# EAGLE design temp (EAGLE 7.1.0)
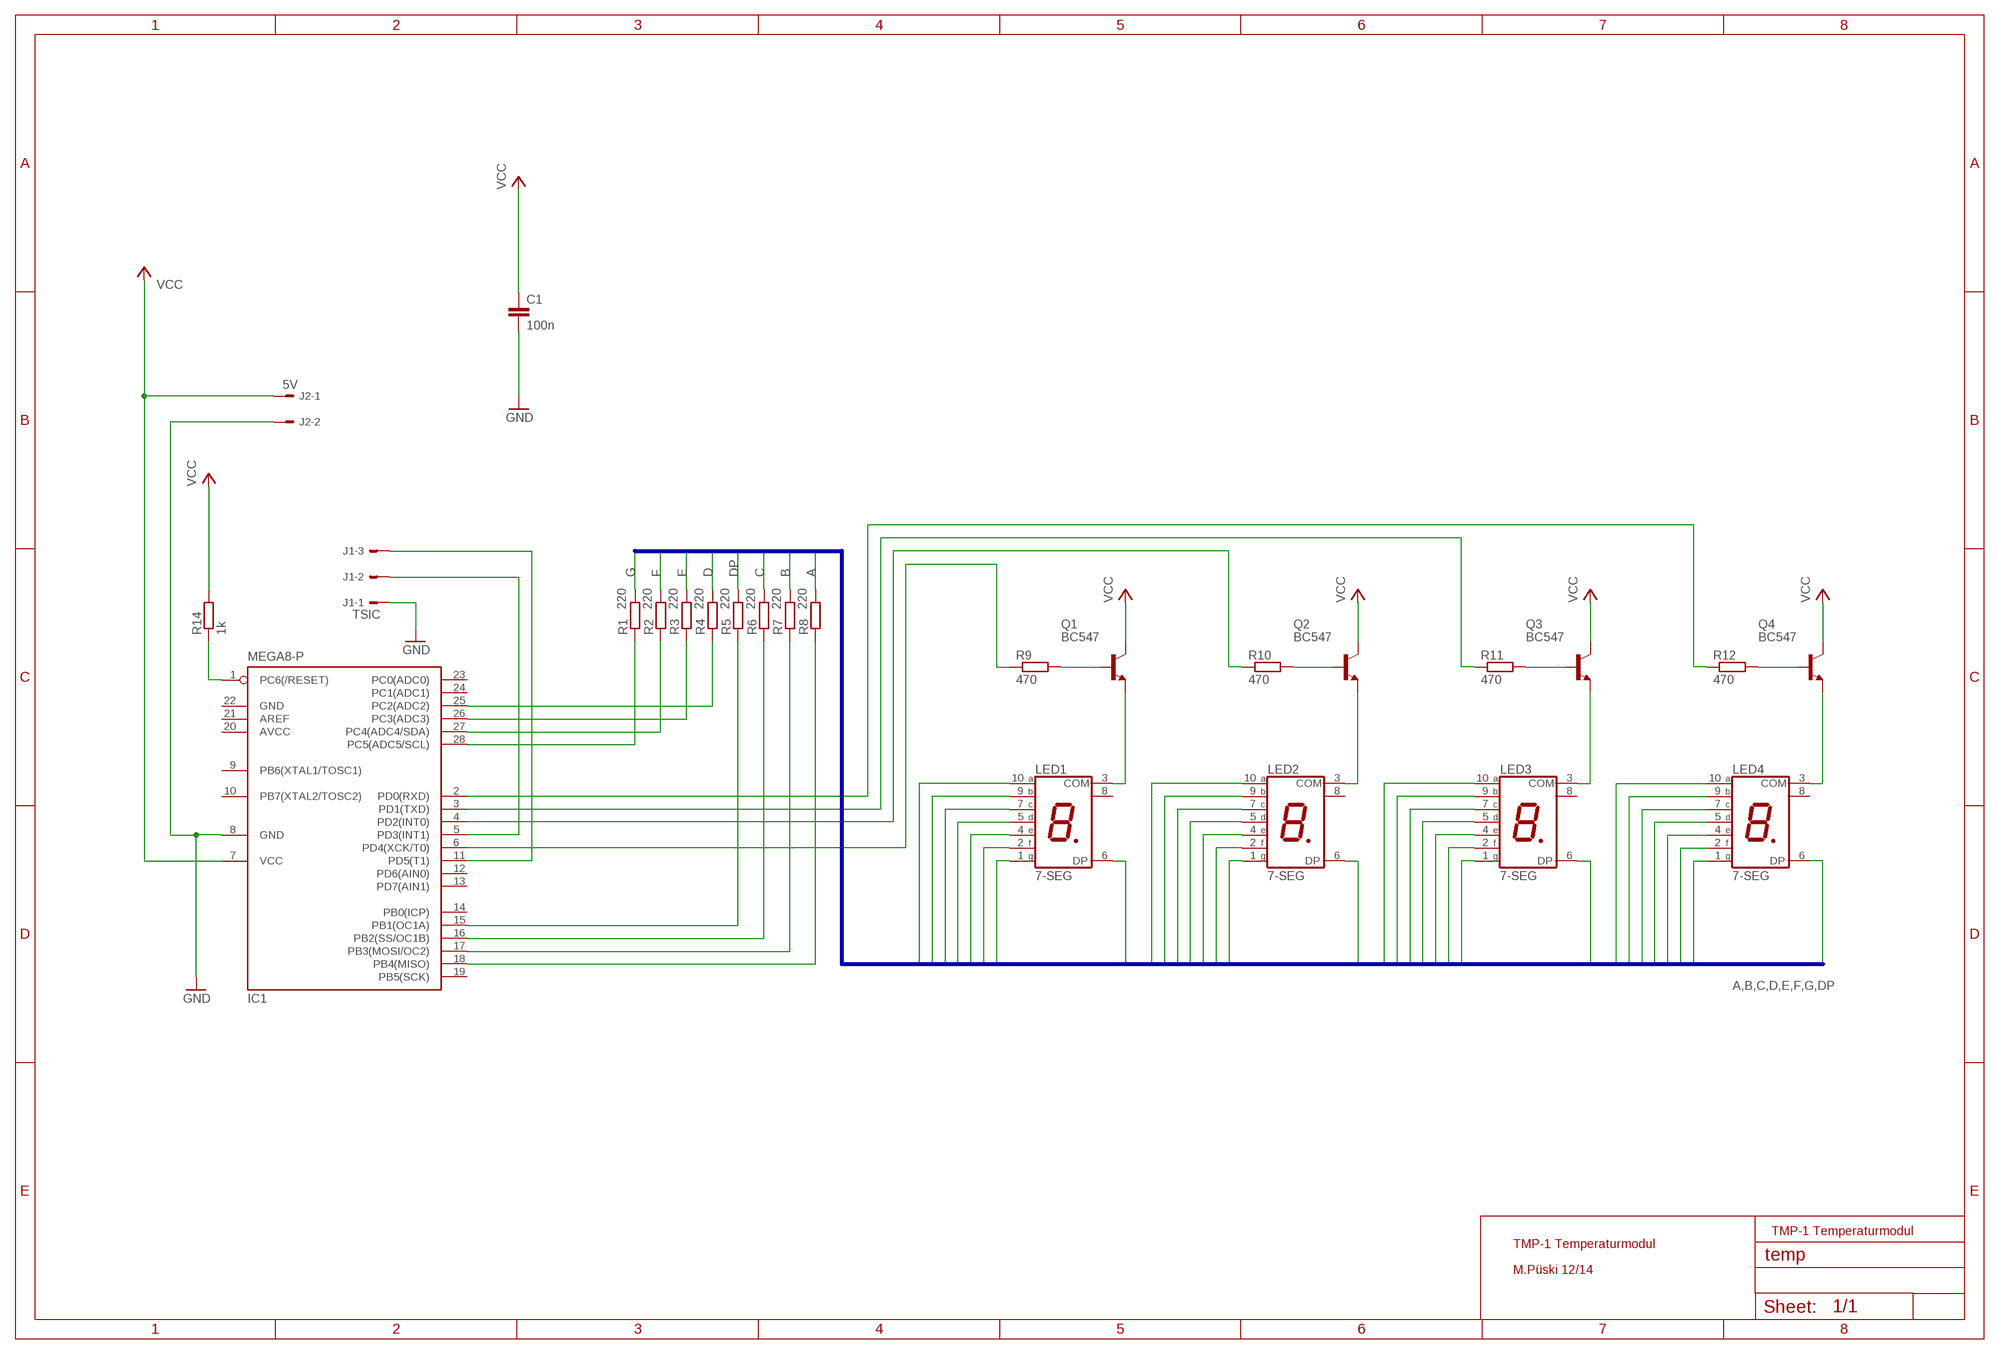
[diagram p0: schematic, sheet 1]

## Parts
C1  100n  C-EU050-024X044  [C050-024X044]
IC1  MEGA8-P  [DIL28-3]
J1  TSIC  22-27-2031-03  [6410-03]
J2  5V  22-27-2021-02  [6410-02]
LED1  7-SEG  7-SEG_SA39-11SRWA  [SA39-11SRWA]
LED2  7-SEG  7-SEG_SA39-11SRWA  [SA39-11SRWA]
LED3  7-SEG  7-SEG_SA39-11SRWA  [SA39-11SRWA]
LED4  7-SEG  7-SEG_SA39-11SRWA  [SA39-11SRWA]
Q1  BC547  [TO92]
Q2  BC547  [TO92]
Q3  BC547  [TO92]
Q4  BC547  [TO92]
R1  220  R-EU_0204_7  [0204/7]
R2  220  R-EU_0204_7  [0204/7]
R3  220  R-EU_0204_2V  [0204V]
R4  220  R-EU_0204_7  [0204/7]
R5  220  R-EU_0204_7  [0204/7]
R6  220  R-EU_0204_7  [0204/7]
R7  220  R-EU_0204_7  [0204/7]
R8  220  R-EU_0204_7  [0204/7]
R9  470  R-EU_0204_7  [0204/7]
R10  470  R-EU_0204_7  [0204/7]
R11  470  R-EU_0204_2V  [0204V]
R12  470  R-EU_0204_7  [0204/7]
R14  1k  R-EU_0204_7  [0204/7]

## Nets
A: LED1.10(A) LED2.10(A) LED3.10(A) LED4.10(A) R8.2
B: LED1.9(B) LED2.9(B) LED3.9(B) LED4.9(B) R7.2
C: LED1.7(C) LED2.7(C) LED3.7(C) LED4.7(C) R6.2
D: LED1.5(D) LED2.5(D) LED3.5(D) LED4.5(D) R4.2
DP: LED1.6(DP) LED2.6(DP) LED3.6(DP) LED4.6(DP) R5.2
E: LED1.4(E) LED2.4(E) LED3.4(E) LED4.4(E) R3.2
F: LED1.2(F) LED2.2(F) LED3.2(F) LED4.2(F) R2.2
G: LED1.1(G) LED2.1(G) LED3.1(G) LED4.1(G) R1.2
GND: C1.2 IC1.8(GND) J1.1 J2.2
N$2: IC1.27(PC4(ADC4/SDA)) R2.1
N$3: IC1.26(PC3(ADC3)) R3.1
N$4: IC1.25(PC2(ADC2)) R4.1
N$5: IC1.15(PB1(OC1A)) R5.1
N$6: IC1.16(PB2(SS/OC1B)) R6.1
N$7: IC1.17(PB3(MOSI/OC2)) R7.1
N$8: IC1.18(PB4(MISO)) R8.1
N$9: Q1.2(B) R9.2
N$10: Q2.2(B) R10.2
N$11: Q3.2(B) R11.2
N$12: LED3.3(COM) Q3.1(E)
N$13: LED2.3(COM) Q2.1(E)
N$14: LED1.3(COM) Q1.1(E)
N$15: IC1.2(PD0(RXD)) R12.1
N$16: IC1.3(PD1(TXD)) R11.1
N$17: IC1.4(PD2(INT0)) R10.1
N$18: IC1.28(PC5(ADC5/SCL)) R1.1
N$19: Q4.2(B) R12.2
N$20: LED4.3(COM) Q4.1(E)
N$21: IC1.1(PC6(/RESET)) R14.1
N$22: IC1.6(PD4(XCK/T0)) R9.1
N$23: IC1.11(PD5(T1)) J1.3
N$24: IC1.5(PD3(INT1)) J1.2
VCC: C1.1 IC1.7(VCC) J2.1 Q1.3(C) Q2.3(C) Q3.3(C) Q4.3(C) R14.2
Unconnected: IC1.9(PB6(XTAL1/TOSC1)) IC1.10(PB7(XTAL2/TOSC2)) IC1.12(PD6(AIN0)) IC1.13(PD7(AIN1)) IC1.14(PB0(ICP)) IC1.19(PB5(SCK)) IC1.21(AREF) IC1.23(PC0(ADC0)) IC1.24(PC1(ADC1)) LED1.8(COM) LED2.8(COM) LED3.8(COM) LED4.8(COM)

## Buses
A,B,C,D,E,F,G,DP

## Notes on the sheet
- TMP-1 Temperaturmodul
- TMP-1 Temperaturmodul
- M.Püski 12/14

## Power pins joined to a net without a drawn wire
AVCC: IC1.20(AVCC)
GND: IC1.22(GND)

## Library data of the parts
C1 = rcl:C-EU: CAPACITOR, European symbol
IC1 = atmel:MEGA8-P: MICROCONTROLLER 8 Kbytes FLASH, 1 kbytes SRAM, 512 bytes EEPROM, USART, 4-channel 10 bit ADC, 2-channel 8 bit ADC Pin compatible with Atmega48, ATMega88, ATMega168 Source: avr.lbr; OC_FARNELL: unknown; OC_NEWARK: unknown
J1 = con-molex:22-?-03: CONNECTOR wire to board 2.54 mm (.1 inch) pitch header; OC_FARNELL: unknown; OC_NEWARK: unknown
J2 = con-molex:22-?-02: CONNECTOR wire to board 2.54 mm (.1 inch) pitch header; OC_FARNELL: unknown; OC_NEWARK: unknown
LED1-LED4 = display-kingbright:7-SEG_: Kingbright 14.2mm (0.56 INCH) SINGLE DIGIT NUMERIC DUISPLAY Source: SA56-11EWA(Ver1189471036.pdf; OC_FARNELL: unknown; OC_NEWARK: unknown
Q1-Q4 = transistor-npn:BC547*: NPN Transistor
R1-R12 R14 = resistor:R-EU_: RESISTOR, European symbol; SPICEPREFIX: R

## Board
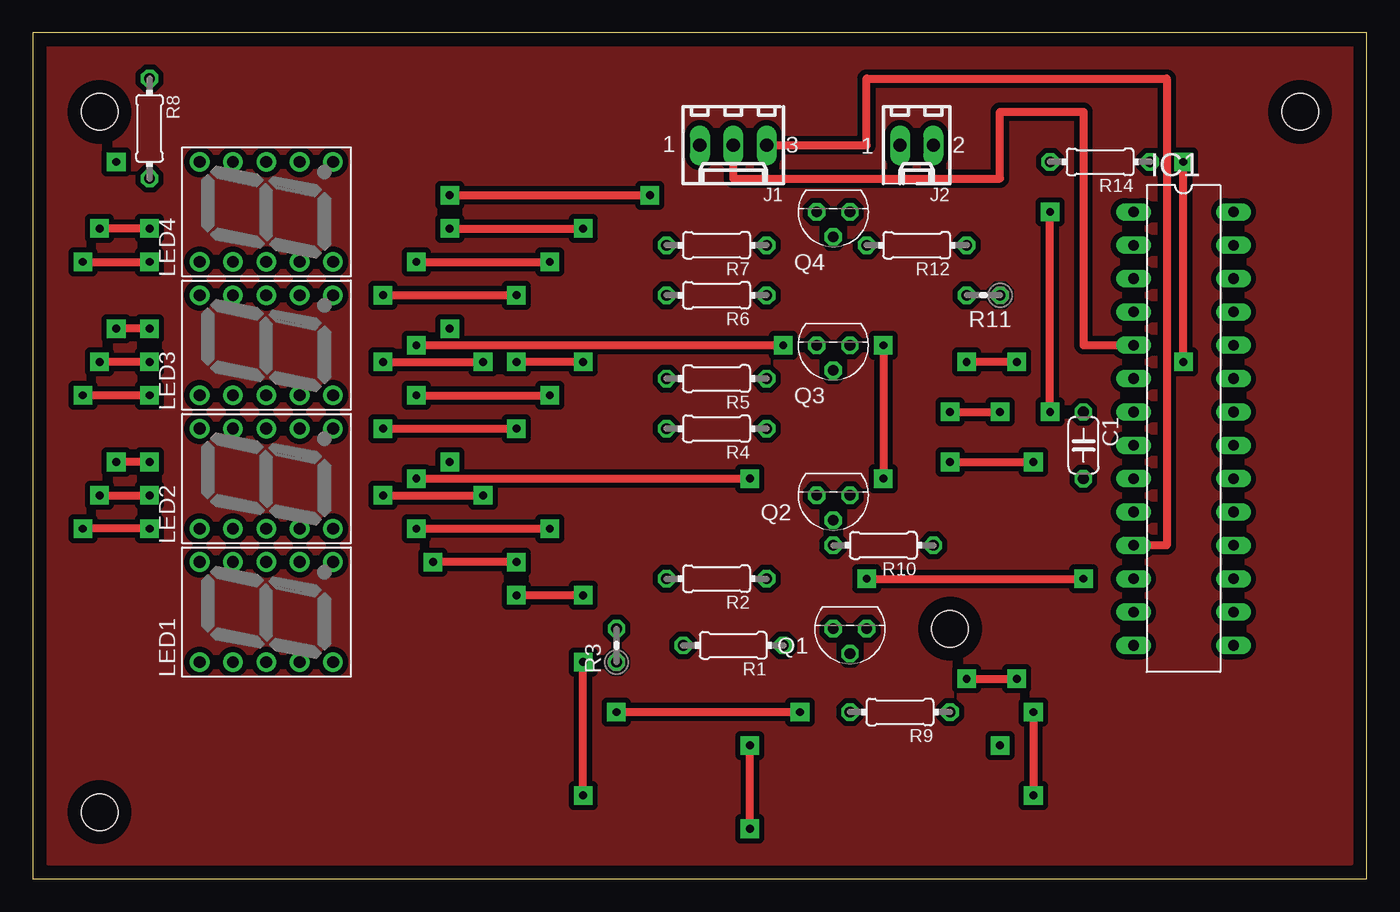
[diagram p1: board, top side]
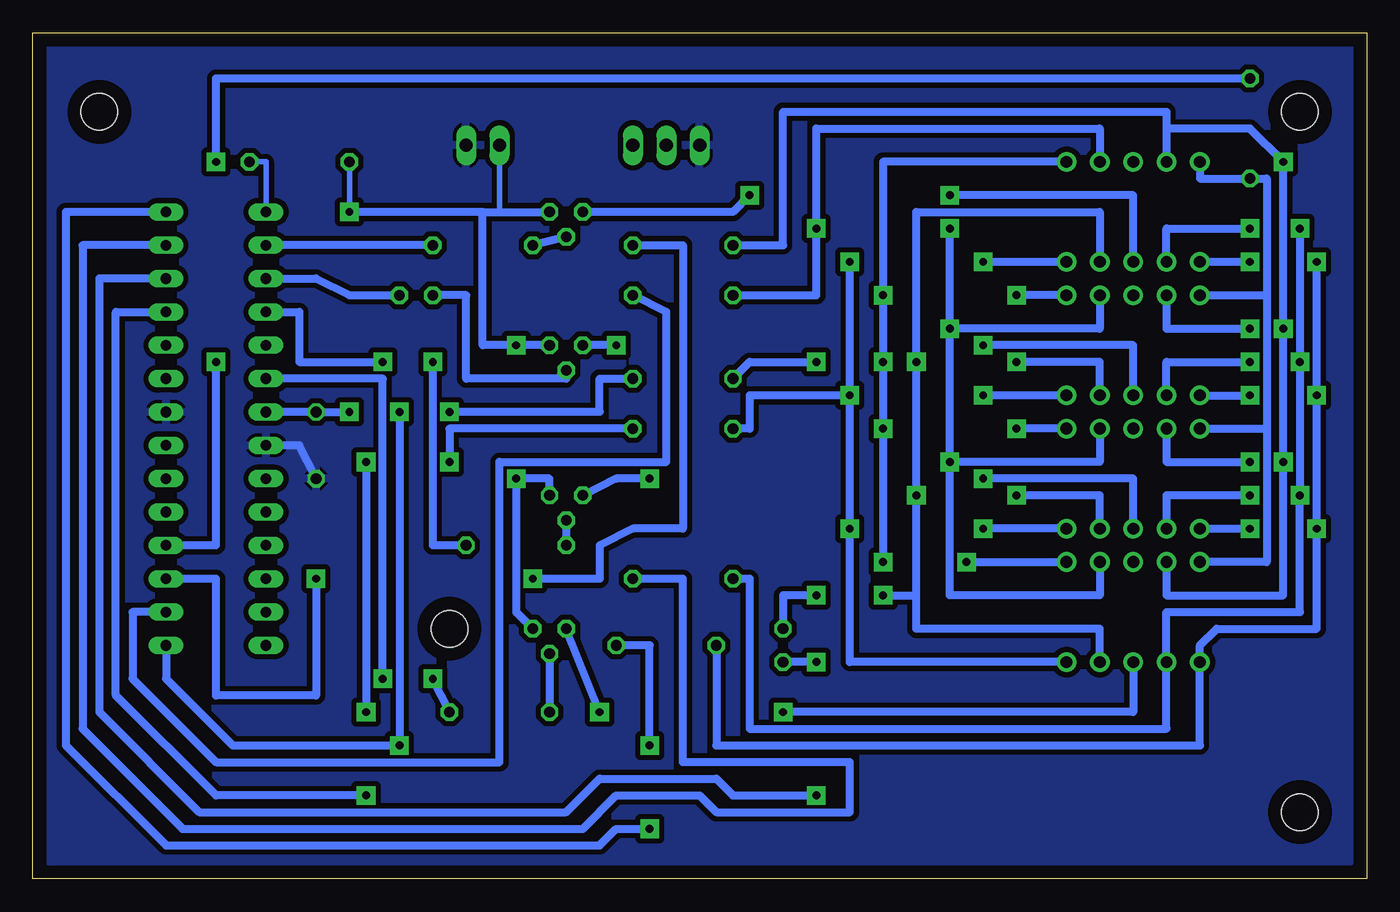
[diagram p2: board, bottom side, seen from below]

Size 101.58 x 64.44 mm. Coordinates in mm from the lower left corner, seen from the top.
Outline: 0,0 101.58,0 101.58,64.44 0,64.44 0,0
Copper layers (1*16): Top 0.035mm / dielectric 1.5mm / Bottom 0.035mm
Design rules "default *": minimum track width 10mil, minimum drill 24mil, track to track 8mil, track to pad 8mil, pad to pad 8mil, via to via 8mil, smd to smd 8mil, copper to edge 40mil, drill to drill 8mil, minimum pad ring 10mil, minimum via ring 16mil, stop-mask expansion 4mil, vias tented up to drill 0mil, thermal gap 10mil
Holes 2.8 mm at 69.85,19.05 96.52,58.42 5.08,5.08 5.08,58.42

### Footprints (pad centres in the part's own frame; a part is rotated, then mirrored left to right if it is on the bottom)
C050-024X044 = drill 0.813 octagon: 1 -2.54,0; 2 2.54,0
DIL28-3 = drill 0.813 long: 1 -16.51,-3.81; 2 -13.97,-3.81; 3 -11.43,-3.81; 4 -8.89,-3.81; 5 -6.35,-3.81; 6 -3.81,-3.81; 7 -1.27,-3.81; 8 1.27,-3.81; 9 3.81,-3.81; 10 6.35,-3.81; 11 8.89,-3.81; 12 11.43,-3.81; 13 13.97,-3.81; 14 16.51,-3.81; 15 16.51,3.81; 16 13.97,3.81; 17 11.43,3.81; 18 8.89,3.81; 19 6.35,3.81; 20 3.81,3.81; 21 1.27,3.81; 22 -1.27,3.81; 23 -3.81,3.81; 24 -6.35,3.81; 25 -8.89,3.81; 26 -11.43,3.81; 27 -13.97,3.81; 28 -16.51,3.81
6410-03 = drill 1.016 long: 1 2.54,0; 2 0,0; 3 -2.54,0
6410-02 = drill 1.016 long: 1 1.27,0; 2 -1.27,0
SA39-11SRWA = drill 0.9 pad 1.5: 1 -3.81,5.08; 2 -3.81,2.54; 3 -3.81,0; 4 -3.81,-2.54; 5 -3.81,-5.08; 6 3.81,-5.08; 7 3.81,-2.54; 8 3.81,0; 9 3.81,2.54; 10 3.81,5.08
TO92 = drill 0.813 octagon: 1 1.27,0; 2 0,1.905; 3 -1.27,0
0204/7 = drill 0.813 octagon: 1 -3.81,0; 2 3.81,0
0204V = drill 0.813 octagon: 1 -1.27,0; 2 1.27,0

### Placement (x,y rotation side)
C1  80.01,33.02 270 top
IC1  87.63,34.29 270 top
J1  53.34,55.88 180 top
J2  67.31,55.88 180 top
LED1  17.78,20.32 90 top
LED2  17.78,30.48 90 top
LED3  17.78,40.64 90 top
LED4  17.78,50.8 90 top
Q1  62.23,19.05 180 top
Q2  60.96,29.21 180 top
Q3  60.96,40.64 180 top
Q4  60.96,50.8 180 top
R1  53.34,17.78 180 top
R2  52.07,22.86 180 top
R3  44.45,17.78 90 top
R4  52.07,34.29 180 top
R5  52.07,38.1 180 top
R6  52.07,44.45 180 top
R7  52.07,48.26 180 top
R8  8.89,57.15 270 top
R9  66.04,12.7 180 top
R10  64.77,25.4 180 top
R11  72.39,44.45 180 top
R12  67.31,48.26 180 top
R14  81.28,54.61 180 top

### Tracks (layer width: path | path; a pad name or v marks a point on that pad's centre or on a via)
A
  Bottom 0.61: LED2.10 7.62,34.29 | 7.62,34.29 7.62,24.13 LED1.10 | LED3.10 7.62,44.45 | 7.62,44.45 7.62,34.29 | 7.62,44.45 7.62,53.34 R8.2 12.7,53.34 LED4.10
B  (via drill 0.6)
  Top 0.61: v8.89,31.75 v6.35,31.75 | v8.89,41.91 v6.35,41.91
  Bottom 0.61: LED1.9 15.24,21.59 6.35,21.59 v6.35,31.75 v6.35,41.91 v6.35,54.61 8.89,57.15 15.24,57.15 | 15.24,57.15 LED4.9 | LED2.9 15.24,31.75 v8.89,31.75 | LED3.9 15.24,41.91 v8.89,41.91 | R7.2 44.45,48.26 44.45,58.42 15.24,58.42 15.24,57.15
C  (via drill 0.6)
  Top 0.61: v31.75,49.53 v41.91,49.53
  Bottom 0.61: LED1.7 20.32,21.59 31.75,21.59 v31.75,31.75 | v31.75,31.75 v31.75,41.91 | v31.75,41.91 v31.75,49.53 | LED4.7 20.32,57.15 41.91,57.15 v41.91,49.53 41.91,44.45 R6.2 | LED3.7 20.32,41.91 v31.75,41.91 | LED2.7 20.32,31.75 v31.75,31.75
D  (via drill 0.6)
  Top 0.61: v29.21,46.99 v39.37,46.99 | v29.21,26.67 v39.37,26.67 | v29.21,36.83 v39.37,36.83
  Bottom 0.61: LED4.5 v29.21,46.99 | LED1.5 39.37,16.51 v39.37,26.67 v39.37,36.83 | v39.37,36.83 v39.37,46.99 | LED2.5 v29.21,26.67 | LED3.5 v29.21,36.83 | v39.37,36.83 46.99,36.83 46.99,34.29 R4.2
DP  (via drill 0.6)
  Top 0.61: v36.83,24.13 v30.48,24.13 | v26.67,44.45 v36.83,44.45 | v26.67,34.29 v36.83,34.29 | v41.91,39.37 v36.83,39.37
  Bottom 0.61: v36.83,24.13 v36.83,34.29 v36.83,39.37 v36.83,44.45 36.83,54.61 LED4.6 | v30.48,24.13 LED1.6 | LED3.6 v26.67,44.45 | LED2.6 v26.67,34.29 | R5.2 46.99,39.37 v41.91,39.37
E  (via drill 0.6)
  Top 0.61: v26.67,39.37 v34.29,39.37 | v26.67,29.21 v34.29,29.21 | v41.91,21.59 v36.83,21.59
  Bottom 0.61: LED1.4 20.32,19.05 34.29,19.05 34.29,21.59 | 34.29,21.59 v34.29,29.21 v34.29,39.37 34.29,50.8 20.32,50.8 LED4.4 | LED3.4 20.32,39.37 v26.67,39.37 | LED2.4 20.32,29.21 v26.67,29.21 | v36.83,21.59 34.29,21.59 | v41.91,21.59 44.45,21.59 R3.2
F  (via drill 0.6)
  Top 0.61: v5.08,29.21 v8.89,29.21 | v8.89,49.53 v5.08,49.53 | v8.89,39.37 v5.08,39.37
  Bottom 0.61: v8.89,29.21 15.24,29.21 LED2.2 | LED4.2 15.24,49.53 v8.89,49.53 | v5.08,49.53 v5.08,39.37 v5.08,29.21 5.08,20.32 15.24,20.32 LED1.2 15.24,11.43 46.99,11.43 46.99,22.86 R2.2 | LED3.2 15.24,39.37 v8.89,39.37
G  (via drill 0.6)
  Top 0.61: v3.81,46.99 v8.89,46.99 | v8.89,26.67 v3.81,26.67 | v8.89,36.83 v3.81,36.83
  Bottom 0.61: v3.81,46.99 v3.81,36.83 v3.81,26.67 3.81,19.05 11.43,19.05 12.7,17.78 LED1.1 12.7,10.16 49.53,10.16 R1.2 | v8.89,46.99 LED4.1 | LED2.1 v8.89,26.67 | LED3.1 v8.89,36.83
GND
  Bottom 0.61: C1.2 81.28,33.02 IC1.8
  pour Bottom (isolate 0.406): 1.27,63.5 100.33,63.5 100.33,1.27 1.27,1.27
N$1
  pour Top (isolate 0.406): 1.27,63.5 100.33,63.5 100.33,1.27 1.27,1.27
N$2
  Bottom 0.61: IC1.27 97.79,48.26 97.79,11.43 90.17,3.81 59.69,3.81 57.15,6.35 50.8,6.35 49.53,5.08 39.37,5.08 39.37,8.89 52.07,8.89 52.07,22.86 R2.1
N$3  (via drill 0.6)
  Top 0.61: v41.91,6.35 v41.91,16.51
  Bottom 0.61: IC1.26 96.52,45.72 96.52,12.7 88.9,5.08 60.96,5.08 58.42,7.62 49.53,7.62 48.26,6.35 v41.91,6.35 | v41.91,16.51 R3.1
N$4  (via drill 0.6)
  Top 0.61: v69.85,31.75 v76.2,31.75 | v76.2,12.7 v76.2,6.35
  Bottom 0.61: R4.1 69.85,34.29 v69.85,31.75 | v76.2,31.75 v76.2,12.7 | v76.2,6.35 87.63,6.35 95.25,13.97 95.25,43.18 IC1.25
N$5  (via drill 0.6)
  Top 0.61: v69.85,35.56 v73.66,35.56
  Bottom 0.61: IC1.15 91.44,15.24 86.36,10.16 v73.66,10.16 v73.66,35.56 | R5.1 58.42,38.1 58.42,35.56 v69.85,35.56
N$6
  Bottom 0.61: IC1.16 93.98,20.32 93.98,15.24 87.63,8.89 66.04,8.89 66.04,31.75 53.34,31.75 53.34,43.18 R6.1
N$7  (via drill 0.6)
  Top 0.61: v63.5,22.86 v80.01,22.86
  Bottom 0.61: R7.1 52.07,48.26 52.07,26.67 55.88,26.67 58.42,25.4 58.42,22.86 v63.5,22.86 | v80.01,22.86 80.01,13.97 87.63,13.97 87.63,22.86 IC1.17
N$8  (via drill 0.6)
  Top 0.61: v87.63,39.37 v87.63,54.61
  Bottom 0.61: R8.1 87.63,60.96 v87.63,54.61 | IC1.18 87.63,25.4 v87.63,39.37
N$9
  Bottom 0.61: Q1.2 R9.2
N$10
  Bottom 0.61: Q2.2 R10.2
N$11
  Bottom 0.61: Q3.2 60.96,38.1 68.58,38.1 68.58,44.45 R11.2
N$12  (via drill 0.6)
  Top 0.61: v29.21,40.64 v57.15,40.64
  Bottom 0.61: LED3.3 17.78,40.64 v29.21,40.64 | v57.15,40.64 Q3.1
N$13  (via drill 0.6)
  Top 0.61: v29.21,30.48 v54.61,30.48
  Bottom 0.61: LED2.3 17.78,30.48 v29.21,30.48 | v54.61,30.48 57.15,30.48 Q2.1
N$14  (via drill 0.6)
  Top 0.61: v44.45,12.7 v58.42,12.7
  Bottom 0.61: LED1.3 17.78,12.7 v44.45,12.7 | v58.42,12.7 Q1.1
N$15
  Bottom 0.61: R12.1 IC1.2
N$16
  Bottom 0.61: IC1.3 80.01,45.72 77.47,44.45 R11.1
N$17  (via drill 0.6)
  Top 0.61: v74.93,39.37 v71.12,39.37
  Bottom 0.61: IC1.4 81.28,43.18 81.28,39.37 v74.93,39.37 | R10.1 71.12,25.4 v71.12,39.37
N$18  (via drill 0.6)
  Top 0.61: v54.61,3.81 v54.61,10.16
  Bottom 0.61: IC1.28 99.06,50.8 99.06,10.16 91.44,2.54 58.42,2.54 57.15,3.81 v54.61,3.81 | v54.61,10.16 54.61,17.78 R1.1
N$19
  Bottom 0.61: Q4.2 R12.2
N$20  (via drill 0.6)
  Top 0.61: v31.75,52.07 v46.99,52.07
  Bottom 0.61: LED4.3 17.78,52.07 v31.75,52.07 | v46.99,52.07 48.26,50.8 Q4.1
N$21
  Bottom 0.406: R14.1 83.82,54.61 IC1.1
N$22  (via drill 0.6)
  Top 0.61: v71.12,15.24 v74.93,15.24
  Bottom 0.61: R9.1 v71.12,15.24 | v74.93,15.24 74.93,38.1 IC1.6
N$23
  Top 0.61: J1.3 63.5,55.88 63.5,60.96 86.36,60.96 86.36,25.4 IC1.11
N$24
  Top 0.61: J1.2 53.34,53.34 73.66,53.34 73.66,58.42 80.01,58.42 80.01,40.64 IC1.5
VCC  (via drill 0.6)
  Top 0.61: v64.77,40.64 v64.77,30.48 | v77.47,35.56 v77.47,50.8
  Bottom 0.406: J2.1 66.04,50.8 | R14.2 v77.47,50.8
  Bottom 0.61: IC1.7 C1.1 v77.47,35.56 | Q2.3 62.23,30.48 v64.77,30.48 64.77,20.32 Q1.3 | Q3.3 v64.77,40.64 67.31,40.64 67.31,50.8 | 67.31,50.8 66.04,50.8 Q4.3 | 67.31,50.8 v77.47,50.8